# Altium schematic sheet EEM_Connectors.SchDoc
size 420 x 297 mm; SheetNumber: 2; Title2: EEM_Connectors
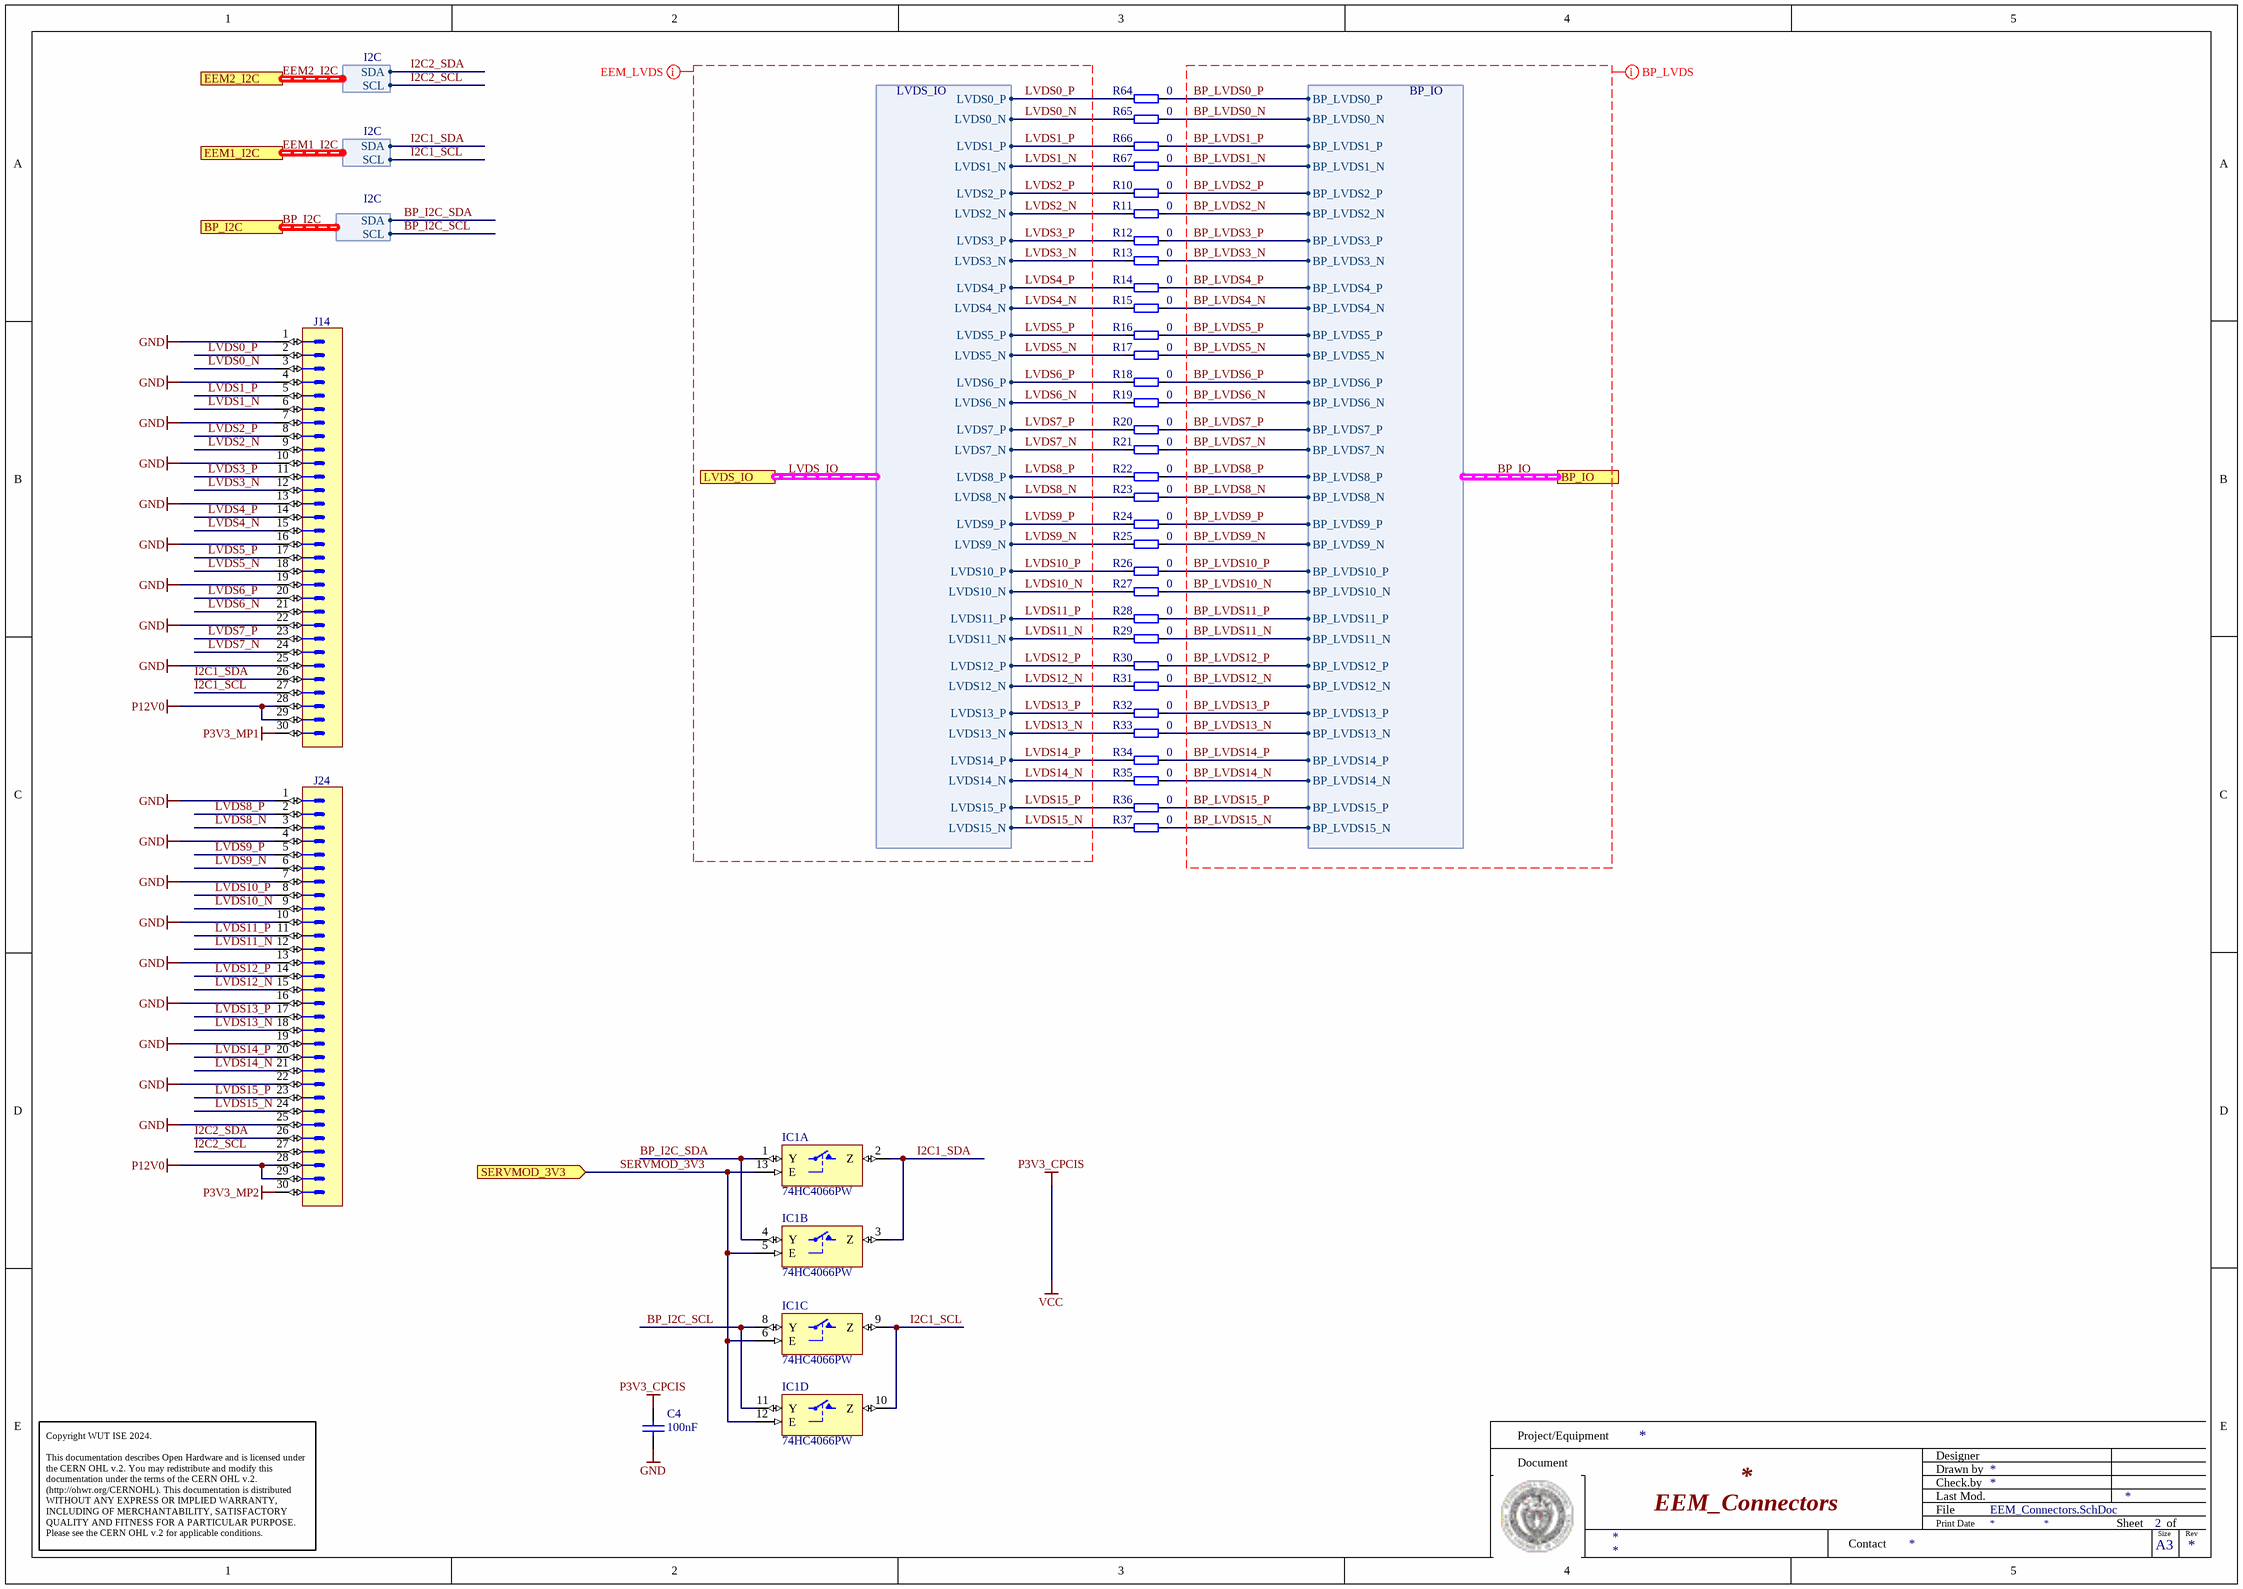
[diagram p0: EEM_Connectors.SchDoc]

## Parts
C4  100nF  [CAPC1608X87N]
IC1  74HC4066PW  [SOP65P640X110-14N]  (parts A,B,C,D of 4)
J14  (no value)  [3M_N2530-6002RB]
J24  (no value)  [3M_N2530-6002RB]
R10  0  [RESC1005X35N]
R11  0  [RESC1005X35N]
R12  0  [RESC1005X35N]
R13  0  [RESC1005X35N]
R14  0  [RESC1005X35N]
R15  0  [RESC1005X35N]
R16  0  [RESC1005X35N]
R17  0  [RESC1005X35N]
R18  0  [RESC1005X35N]
R19  0  [RESC1005X35N]
R20  0  [RESC1005X35N]
R21  0  [RESC1005X35N]
R22  0  [RESC1005X35N]
R23  0  [RESC1005X35N]
R24  0  [RESC1005X35N]
R25  0  [RESC1005X35N]
R26  0  [RESC1005X35N]
R27  0  [RESC1005X35N]
R28  0  [RESC1005X35N]
R29  0  [RESC1005X35N]
R30  0  [RESC1005X35N]
R31  0  [RESC1005X35N]
R32  0  [RESC1005X35N]
R33  0  [RESC1005X35N]
R34  0  [RESC1005X35N]
R35  0  [RESC1005X35N]
R36  0  [RESC1005X35N]
R37  0  [RESC1005X35N]
R64  0  [RESC1005X35N]
R65  0  [RESC1005X35N]
R66  0  [RESC1005X35N]
R67  0  [RESC1005X35N]

## Ports
BP_I2C (harness I2C), BP_IO (harness BP_IO), EEM1_I2C (harness I2C), EEM2_I2C (harness I2C), LVDS_IO (harness LVDS_IO), SERVMOD_3V3 (in)

## Harnesses
I2C: SDA, SCL
LVDS_IO: LVDS0_P, LVDS0_N, LVDS1_P, LVDS1_N, LVDS2_P, LVDS2_N, LVDS3_P, LVDS3_N, LVDS4_P, LVDS4_N, LVDS5_P, LVDS5_N, LVDS6_P, LVDS6_N, LVDS7_P, LVDS7_N, LVDS8_P, LVDS8_N, LVDS9_P, LVDS9_N, LVDS10_P, LVDS10_N, LVDS11_P, LVDS11_N, LVDS12_P, LVDS12_N, LVDS13_P, LVDS13_N, LVDS14_P, LVDS14_N, LVDS15_P, LVDS15_N
BP_IO: BP_LVDS0_P, BP_LVDS0_N, BP_LVDS1_P, BP_LVDS1_N, BP_LVDS2_P, BP_LVDS2_N, BP_LVDS3_P, BP_LVDS3_N, BP_LVDS4_P, BP_LVDS4_N, BP_LVDS5_P, BP_LVDS5_N, BP_LVDS6_P, BP_LVDS6_N, BP_LVDS7_P, BP_LVDS7_N, BP_LVDS8_P, BP_LVDS8_N, BP_LVDS9_P, BP_LVDS9_N, BP_LVDS10_P, BP_LVDS10_N, BP_LVDS11_P, BP_LVDS11_N, BP_LVDS12_P, BP_LVDS12_N, BP_LVDS13_P, BP_LVDS13_N, BP_LVDS14_P, BP_LVDS14_N, BP_LVDS15_P, BP_LVDS15_N

## Nets
GND: C4.1 IC1.7(GND) J14.1 J14.4 J14.7 J14.10 J14.13 J14.16 J14.19 J14.22 J14.25 J24.1 J24.4 J24.7 J24.10 J24.13 J24.16 J24.19 J24.22 J24.25
P3V3_CPCIS: C4.2 IC1.14(VCC)  [also labelled VCC]
P3V3_MP1: J14.30
P3V3_MP2: J24.30
P12V0: J14.28 J14.29 J24.28 J24.29
BP_I2C_SCL: IC1.8(Y) IC1.11(Y) ; port BP_I2C.SCL  [project net BP_I2C.SCL]
BP_I2C_SDA: IC1.1(Y) IC1.4(Y) ; port BP_I2C.SDA  [project net BP_I2C.SDA]
BP_LVDS0_N: R65.1 ; port BP_IO.BP_LVDS0_N  [project net BP_IO.BP_LVDS0_N]
BP_LVDS0_P: R64.1 ; port BP_IO.BP_LVDS0_P  [project net BP_IO.BP_LVDS0_P]
BP_LVDS1_N: R67.1 ; port BP_IO.BP_LVDS1_N  [project net BP_IO.BP_LVDS1_N]
BP_LVDS1_P: R66.1 ; port BP_IO.BP_LVDS1_P  [project net BP_IO.BP_LVDS1_P]
BP_LVDS2_N: R11.1 ; port BP_IO.BP_LVDS2_N  [project net BP_IO.BP_LVDS2_N]
BP_LVDS2_P: R10.1 ; port BP_IO.BP_LVDS2_P  [project net BP_IO.BP_LVDS2_P]
BP_LVDS3_N: R13.1 ; port BP_IO.BP_LVDS3_N  [project net BP_IO.BP_LVDS3_N]
BP_LVDS3_P: R12.1 ; port BP_IO.BP_LVDS3_P  [project net BP_IO.BP_LVDS3_P]
BP_LVDS4_N: R15.1 ; port BP_IO.BP_LVDS4_N  [project net BP_IO.BP_LVDS4_N]
BP_LVDS4_P: R14.1 ; port BP_IO.BP_LVDS4_P  [project net BP_IO.BP_LVDS4_P]
BP_LVDS5_N: R17.1 ; port BP_IO.BP_LVDS5_N  [project net BP_IO.BP_LVDS5_N]
BP_LVDS5_P: R16.1 ; port BP_IO.BP_LVDS5_P  [project net BP_IO.BP_LVDS5_P]
BP_LVDS6_N: R19.1 ; port BP_IO.BP_LVDS6_N  [project net BP_IO.BP_LVDS6_N]
BP_LVDS6_P: R18.1 ; port BP_IO.BP_LVDS6_P  [project net BP_IO.BP_LVDS6_P]
BP_LVDS7_N: R21.1 ; port BP_IO.BP_LVDS7_N  [project net BP_IO.BP_LVDS7_N]
BP_LVDS7_P: R20.1 ; port BP_IO.BP_LVDS7_P  [project net BP_IO.BP_LVDS7_P]
BP_LVDS8_N: R23.1 ; port BP_IO.BP_LVDS8_N  [project net BP_IO.BP_LVDS8_N]
BP_LVDS8_P: R22.1 ; port BP_IO.BP_LVDS8_P  [project net BP_IO.BP_LVDS8_P]
BP_LVDS9_N: R25.1 ; port BP_IO.BP_LVDS9_N  [project net BP_IO.BP_LVDS9_N]
BP_LVDS9_P: R24.1 ; port BP_IO.BP_LVDS9_P  [project net BP_IO.BP_LVDS9_P]
BP_LVDS10_N: R27.1 ; port BP_IO.BP_LVDS10_N  [project net BP_IO.BP_LVDS10_N]
BP_LVDS10_P: R26.1 ; port BP_IO.BP_LVDS10_P  [project net BP_IO.BP_LVDS10_P]
BP_LVDS11_N: R29.1 ; port BP_IO.BP_LVDS11_N  [project net BP_IO.BP_LVDS11_N]
BP_LVDS11_P: R28.1 ; port BP_IO.BP_LVDS11_P  [project net BP_IO.BP_LVDS11_P]
BP_LVDS12_N: R31.1 ; port BP_IO.BP_LVDS12_N  [project net BP_IO.BP_LVDS12_N]
BP_LVDS12_P: R30.1 ; port BP_IO.BP_LVDS12_P  [project net BP_IO.BP_LVDS12_P]
BP_LVDS13_N: R33.1 ; port BP_IO.BP_LVDS13_N  [project net BP_IO.BP_LVDS13_N]
BP_LVDS13_P: R32.1 ; port BP_IO.BP_LVDS13_P  [project net BP_IO.BP_LVDS13_P]
BP_LVDS14_N: R35.1 ; port BP_IO.BP_LVDS14_N  [project net BP_IO.BP_LVDS14_N]
BP_LVDS14_P: R34.1 ; port BP_IO.BP_LVDS14_P  [project net BP_IO.BP_LVDS14_P]
BP_LVDS15_N: R37.1 ; port BP_IO.BP_LVDS15_N  [project net BP_IO.BP_LVDS15_N]
BP_LVDS15_P: R36.1 ; port BP_IO.BP_LVDS15_P  [project net BP_IO.BP_LVDS15_P]
I2C1_SCL: IC1.9(Z) IC1.10(Z) J14.27 ; port EEM1_I2C.SCL  [project net EEM1_I2C.SCL]
I2C1_SDA: IC1.2(Z) IC1.3(Z) J14.26 ; port EEM1_I2C.SDA  [project net EEM1_I2C.SDA]
I2C2_SCL: J24.27 ; port EEM2_I2C.SCL  [project net EEM2_I2C.SCL]
I2C2_SDA: J24.26 ; port EEM2_I2C.SDA  [project net EEM2_I2C.SDA]
LVDS0_N: J14.3 R65.2 ; port LVDS_IO.LVDS0_N
LVDS0_P: J14.2 R64.2 ; port LVDS_IO.LVDS0_P
LVDS1_N: J14.6 R67.2 ; port LVDS_IO.LVDS1_N
LVDS1_P: J14.5 R66.2 ; port LVDS_IO.LVDS1_P
LVDS2_N: J14.9 R11.2 ; port LVDS_IO.LVDS2_N
LVDS2_P: J14.8 R10.2 ; port LVDS_IO.LVDS2_P
LVDS3_N: J14.12 R13.2 ; port LVDS_IO.LVDS3_N
LVDS3_P: J14.11 R12.2 ; port LVDS_IO.LVDS3_P
LVDS4_N: J14.15 R15.2 ; port LVDS_IO.LVDS4_N
LVDS4_P: J14.14 R14.2 ; port LVDS_IO.LVDS4_P
LVDS5_N: J14.18 R17.2 ; port LVDS_IO.LVDS5_N
LVDS5_P: J14.17 R16.2 ; port LVDS_IO.LVDS5_P
LVDS6_N: J14.21 R19.2 ; port LVDS_IO.LVDS6_N
LVDS6_P: J14.20 R18.2 ; port LVDS_IO.LVDS6_P
LVDS7_N: J14.24 R21.2 ; port LVDS_IO.LVDS7_N
LVDS7_P: J14.23 R20.2 ; port LVDS_IO.LVDS7_P
LVDS8_N: J24.3 R23.2 ; port LVDS_IO.LVDS8_N
LVDS8_P: J24.2 R22.2 ; port LVDS_IO.LVDS8_P
LVDS9_N: J24.6 R25.2 ; port LVDS_IO.LVDS9_N
LVDS9_P: J24.5 R24.2 ; port LVDS_IO.LVDS9_P
LVDS10_N: J24.9 R27.2 ; port LVDS_IO.LVDS10_N
LVDS10_P: J24.8 R26.2 ; port LVDS_IO.LVDS10_P
LVDS11_N: J24.12 R29.2 ; port LVDS_IO.LVDS11_N
LVDS11_P: J24.11 R28.2 ; port LVDS_IO.LVDS11_P
LVDS12_N: J24.15 R31.2 ; port LVDS_IO.LVDS12_N
LVDS12_P: J24.14 R30.2 ; port LVDS_IO.LVDS12_P
LVDS13_N: J24.18 R33.2 ; port LVDS_IO.LVDS13_N
LVDS13_P: J24.17 R32.2 ; port LVDS_IO.LVDS13_P
LVDS14_N: J24.21 R35.2 ; port LVDS_IO.LVDS14_N
LVDS14_P: J24.20 R34.2 ; port LVDS_IO.LVDS14_P
LVDS15_N: J24.24 R37.2 ; port LVDS_IO.LVDS15_N
LVDS15_P: J24.23 R36.2 ; port LVDS_IO.LVDS15_P
SERVMOD_3V3: IC1.5(E) IC1.6(E) IC1.12(E) IC1.13(E) ; port SERVMOD_3V3

## Buses and harness runs
harness BP_I2C = port BP_I2C
harness BP_IO = port BP_IO
harness EEM1_I2C = port EEM1_I2C
harness EEM2_I2C = port EEM2_I2C
harness LVDS_IO = port LVDS_IO

## Layout directives
net class EEM_LVDS: LVDS0_N, LVDS0_P, LVDS1_N, LVDS1_P, LVDS2_N, LVDS2_P, LVDS3_N, LVDS3_P, LVDS4_N, LVDS4_P, LVDS5_N, LVDS5_P, LVDS6_N, LVDS6_P, LVDS7_N, LVDS7_P, LVDS8_N, LVDS8_P, LVDS9_N, LVDS9_P, LVDS10_N, LVDS10_P, LVDS11_N, LVDS11_P, LVDS12_N, LVDS12_P, LVDS13_N, LVDS13_P, LVDS14_N, LVDS14_P, LVDS15_N, LVDS15_P, LVDS_IO
net class BP_LVDS: BP_IO, BP_LVDS0_N, BP_LVDS0_P, BP_LVDS1_N, BP_LVDS1_P, BP_LVDS2_N, BP_LVDS2_P, BP_LVDS3_N, BP_LVDS3_P, BP_LVDS4_N, BP_LVDS4_P, BP_LVDS5_N, BP_LVDS5_P, BP_LVDS6_N, BP_LVDS6_P, BP_LVDS7_N, BP_LVDS7_P, BP_LVDS8_N, BP_LVDS8_P, BP_LVDS9_N, BP_LVDS9_P, BP_LVDS10_N, BP_LVDS10_P, BP_LVDS11_N, BP_LVDS11_P, BP_LVDS12_N, BP_LVDS12_P, BP_LVDS13_N, BP_LVDS13_P, BP_LVDS14_N, BP_LVDS14_P, BP_LVDS15_N, BP_LVDS15_P

## Notes on the sheet
- Project/Equipment
- Document
- Designer
- Drawn by
- Check.by
- Copyright WUT ISE 2024.
  This documentation describes Open Hardware and is licensed under the CERN OHL v.2. You may redistribute and modify this documentation under the terms of the CERN OHL v.2. (http://ohwr.org/CERNOHL). This documentation is distributed WITHOUT ANY EXPRESS OR IMPLIED WARRANTY, INCLUDING OF MERCHANTABILITY, SATISFACTORY QUALITY AND FITNESS FOR A PARTICULAR PURPOSE. Please see the CERN OHL v.2 for applicable conditions.
- Contact
- File
- Last Mod.
- Print Date
- Sheet
- Size
- A3
- of
- Rev

## Library data of the parts
C4 = CC0603_100NF_50V_10%_X7R: Non-polarised capacitor; Part Description: SMD Multilayer Chip Ceramic Capacitor; Manufacturer: GENERIC; Manufacturer1 Part Number: 223858615649; Voltage: 50V; TC: X7R; Tolerance: ±10%; Part Number: CC0603_100NF_50V_10%_X7R; Component Kind: Standard; Component Type: Standard; Pin Count: 2; Value: 100nF; Status: Preferred; Manufacturer Part Number: CC0603_100NF_50V_10%_X7R; Case: 0603; Mounted: Yes; Socket: No; SMD: Yes; Sense: No; Manufacturer1 Example: PHYCOMP; Manufacturer1 ComponentHeight: 0.87mm; HelpURL: \\cern.ch\dfs\Applications\Altium\Datasheets\CC0603_X7R_PHYCOMP.pdf; Author: CERN DEM JLC; CreateDate: 03.12.2007; LatestRevisionDate: 03.12.2007
IC1 = 74HC4066PW: Part Description: Quad Single-Pole Single-Throw Analog Switch; Manufacturer: NXP SEMICONDUCTORS; PressFit: No; Bonding: No; Part Number: 74HC4066PW; Component Kind: Standard; Component Type: Standard; Device: 74HC4066PW; PackageDescription: SOP, 0.65mm Pitch; 14 Pin, 4.40mm W X 5.00mm L X 1.20mm H body, IPC Medium Density; Manufacturer Part Number: 74HC4066PW; Pin Count: 14; Case: TSSOP14; Mounted: Yes; Socket: No; SMD: Yes; Sense: No; ComponentHeight: 1.1mm; Author: CERN DEM JLC; HelpURL: \\cern.ch\dfs\Applications\Altium\Datasheets\74HC4066PW.pdf; CreateDate: 19.11.2014; LatestRevisionDate: 19.11.2014
J14 J24 = 3M_N2530-6002RB: Connector 30 Male; Part Description: 30 Contacts - Straight .100'' x .100'' Low Profile Four-Wall Header, 2500 Series; Manufacturer: 3M; PressFit: No; Part Number: 3M_N2530-6002RB; Component Kind: Standard; Component Type: Standard; Pin Count: 30; Family: Header 30; Mounted: Yes; Socket: No; SMD: No; Sense: No; Status: None; Manufacturer Part Number: N2530-6002RB; ComponentHeight: 10.03mm; HelpURL: \\cern.ch\dfs\Applications\Altium\Datasheets\3M_N2530-6002RB.pdf; Author: CERN DEM JLC; CreateDate: 11.02.2009; LatestRevisionDate: 11.08.2009
R10-R37 R64-R67 = R0402_0R_JUMPER: Resistor; Part Description: 1A (0.05R Max DC Resistance) Zero Ohm Jumper; Manufacturer: GENERIC; Manufacturer1 Part Number: 232270591001L; Part Number: R0402_0R_JUMPER; Component Kind: Standard; Component Type: Standard; Footprint: RESC1005X40N; Pin Count: 2; Value: 0; Status: Not recommended; Manufacturer Part Number: R0402_0R_JUMPER; Case: 0402; Mounted: Yes; Sense: No; Socket: No; SMD: Yes; Manufacturer1 Example: YAGEO PHYCOMP; Manufacturer1 ComponentHeight: 0.4mm; HelpURL: \\cern.ch\dfs\Applications\Altium\Datasheets\R0402_Phycomp_RC0402.pdf; Author: CERN DEM JLC; CreateDate: 03.12.2007; LatestRevisionDate: 17.10.2012